# EAGLE schematic xio (EAGLE 5.02)
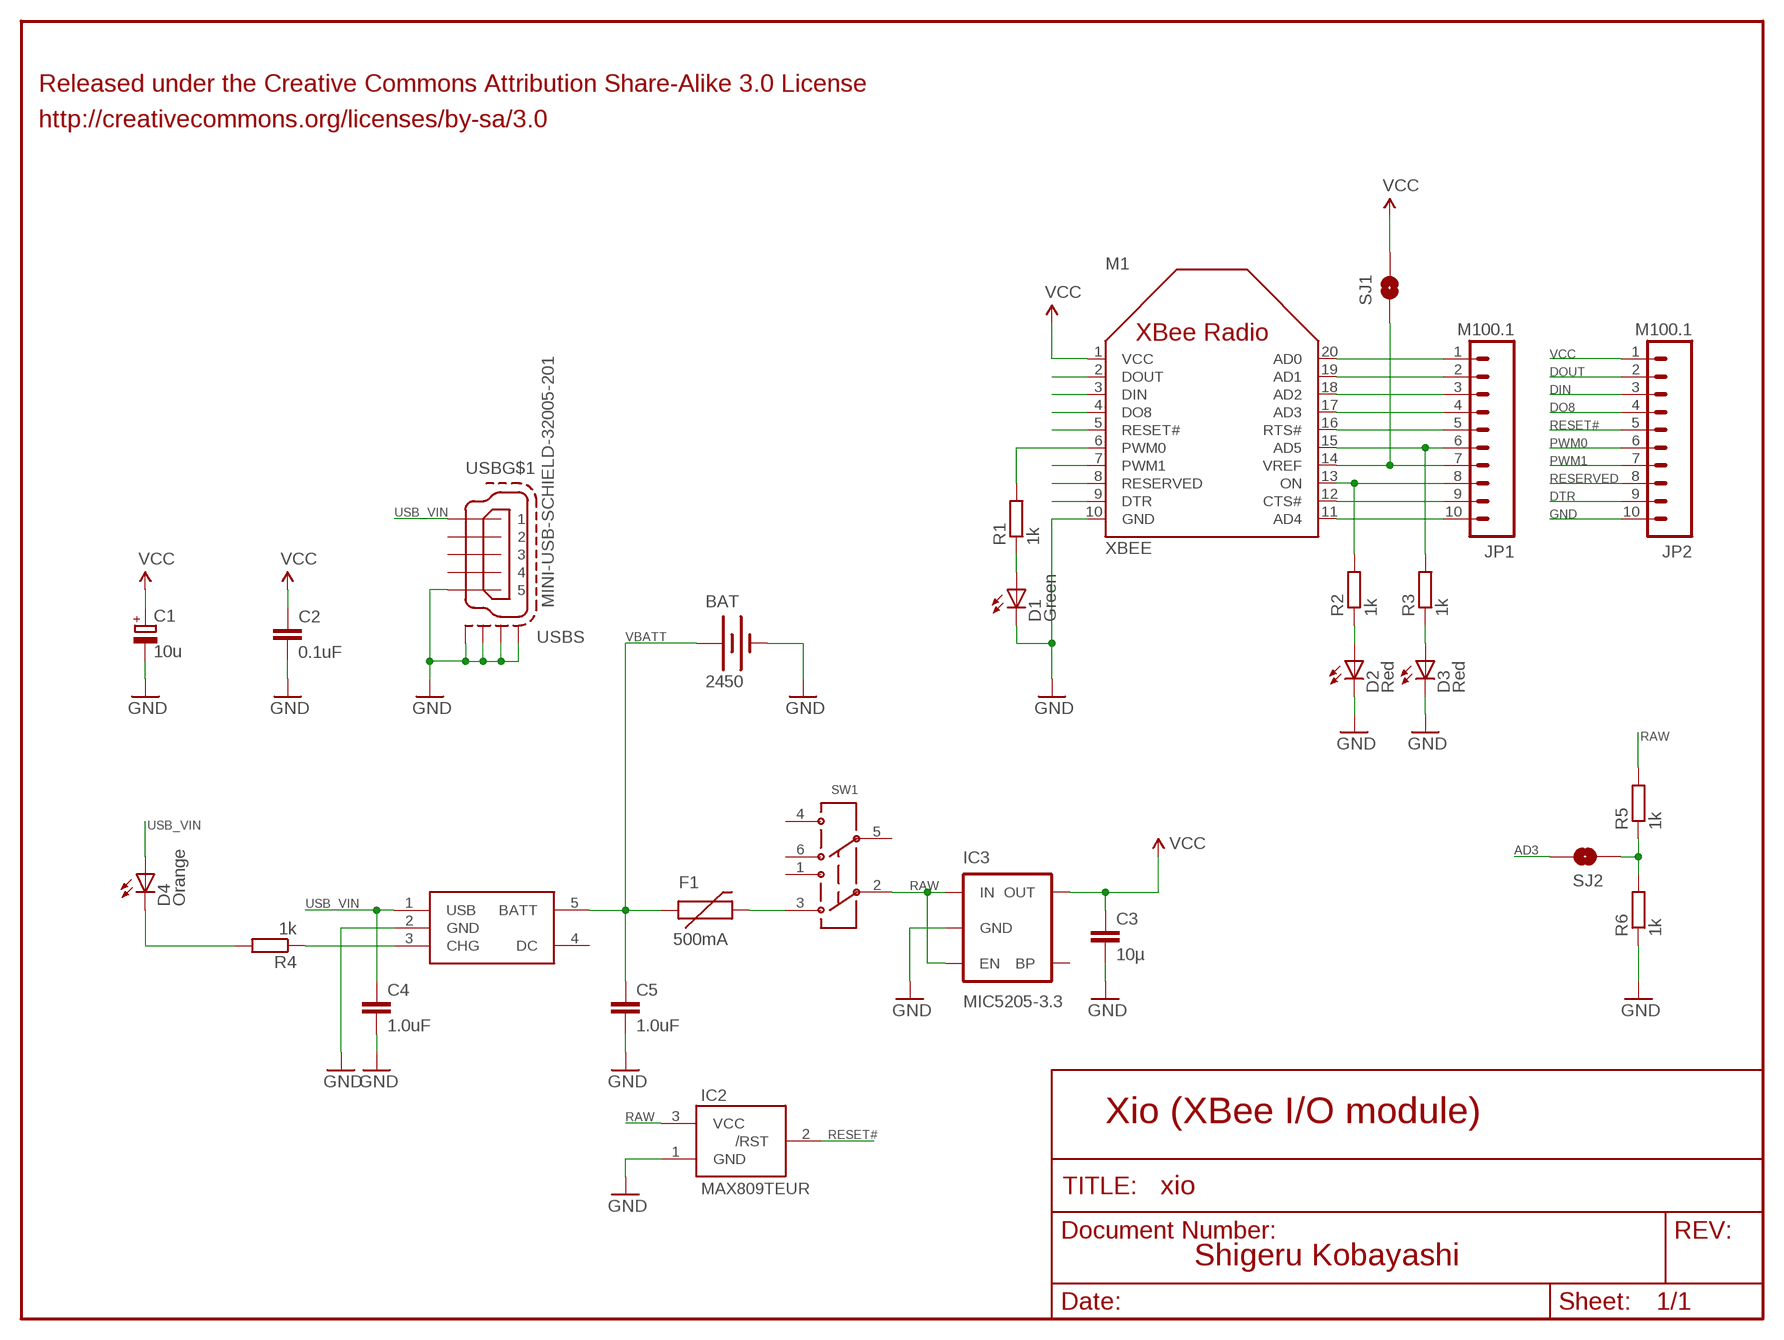
[diagram p0: schematic, sheet 1]

## Parts
BAT  2450  BATTERY  [3009]
C1  10u  CPOL-EUC  [PANASONIC_C]
C2  0.1uF  CAP0603  [0603]
C3  10µ  C-EUC0805K  [C0805K]
C4  1.0uF  CAP0603  [0603]
C5  1.0uF  CAP0603  [0603]
D1  Green  LEDCHIPLED_0805  [CHIPLED_0805]
D2  Red  LEDCHIPLED_0805  [CHIPLED_0805]
D3  Red  LEDCHIPLED_0805  [CHIPLED_0805]
D4  Orange  LEDCHIPLED_0805  [CHIPLED_0805]
F1  500mA  PTCSMD  [PTC-1206]
IC1  MAX1555  [SOT23-5]
IC2  MAX809TEUR  [SOT23]
IC3  MIC5205-3.3  V_REG_LDOSMD  [SOT23-5]
JP1  M100.1  [1X10]
JP2  M100.1  [1X10]
M1  XBEE  [XBEE]
R1  1k  R-EU_R0603  [R0603]
R2  1k  R-EU_R0603  [R0603]
R3  1k  R-EU_R0603  [R0603]
R4  1k  R-EU_R0603  [R0603]
R5  1k  R-EU_R0603  [R0603]
R6  1k  R-EU_R0603  [R0603]
SJ1  SOLDERJUMPERNO  [SJ-NO]
SJ2  SOLDERJUMPERNO  [SJ-NO]
SW1  AYZ0202  [AYZ0202]
USB  MINI-USB-SCHIELD-32005-201  [32005-201]

## Nets
AD3: JP1.4 M1.17(AD3) SJ2.2
AD4: JP1.10 M1.11(AD4)
DIN: JP2.3 M1.3(DIN)
DO8: JP2.4 M1.4(DO8)
DOUT: JP2.2 M1.2(DOUT)
DTR: JP2.9 M1.9(DTR)
GND: BAT.- C1.- C2.2 C3.2 C4.2 C5.2 D1.C D2.C D3.C IC1.2(GND) IC2.1(GND) IC3.2(GND) JP2.10 M1.10(GND) R6.1 USB.5 USB.M1(S:S1) USB.M2(S:S2) USB.M3(S:S3) USB.M4(S:S4)
N$1: JP1.8 M1.13(ON) R2.2
N$2: JP1.1 M1.20(AD0)
N$3: D1.A R1.1
N$6: D2.A R2.1
N$7: JP1.2 M1.19(AD1)
N$8: D4.C R4.2
N$9: F1.2 SW1.3
N$10: JP1.3 M1.18(AD2)
N$11: IC1.3(CHG) R4.1
N$13: JP1.5 M1.16(RTS#)
N$14: JP1.6 M1.15(AD5) R3.2
N$15: JP1.7 M1.14(VREF) SJ1.1
N$16: JP1.9 M1.12(CTS#)
N$18: D3.A R3.1
N$19: R5.1 R6.2 SJ2.1
PWM0: JP2.6 M1.6(PWM0) R1.2
PWM1: JP2.7 M1.7(PWM1)
RAW: IC2.3(VCC) IC3.1(IN) IC3.3(EN) R5.2 SW1.2
RESERVED: JP2.8 M1.8(RESERVED)
RESET#: IC2.2(/RST) JP2.5 M1.5(RESET#)
USB_VIN: C4.1 D4.A IC1.1(USB) USB.1
VBATT: BAT.+@1(+) C5.1 F1.1 IC1.5(BATT)
VCC [VCC]: C1.+ C2.1 C3.1 IC3.5(OUT) JP2.1 M1.1(VCC) SJ1.2
Unconnected: IC1.4(DC) IC3.4(BP) SW1.1 SW1.4 SW1.5 SW1.6 USB.2 USB.3 USB.4

## Notes on the sheet
- Released under the Creative Commons Attribution Share-Alike 3.0 License
- http://creativecommons.org/licenses/by-sa/3.0
- Xio (XBee I/O module)
- Shigeru Kobayashi

## Library data of the parts
BAT = keystone:BATTERY: Battery Holders 2032 coin cell and 2450 coin cell.
C1 = rcl:CPOL-EU: POLARIZED CAPACITOR, European symbol
C2 C4 C5 = SparkFun:CAP: Capacitor Standard 0603 ceramic capacitor, and 0.1" leaded capacitor.
C3 = rcl:C-EU: CAPACITOR, European symbol
D1-D4 = led:LED: LED OSRAM: - CHIPLED LG R971, LG N971, LY N971, LG Q971, LY Q971, LO R971, LY R971 LH N974, LH R974 LS Q976, LO Q976, LY Q976 LO Q996 - Hyper CHIPLED LW Q18S LB Q993, LB Q99A, LB R99A - SideLED LS A670, LO A670, LY A670, LG A670, LP A670 LB A673, LV A673, LT A673, LW A673 LH A674 LY A675 LS A676, LA A676, LO A676, LY A676, LW A676 LS A679, LY A679, LG A679 - Hyper Micro SIDELED® LS Y876, LA Y876, LO Y876, LY Y876 LT Y87S - SmartLED LW L88C, LW L88S LB L89C, LB L89S, LG L890 LS L89K, LO L89K, LY L89K LS L896, LA L896, LO L896, LY L896 - TOPLED LS T670, LO T670, LY T670, LG T670, LP T670 LSG T670, LSP T670, LSY T670, LOP T670, LYG T670 LG T671, LOG T671, LSG T671 LB T673, LV T673, LT T673, LW T673 LH T674 LS T676, LA T676, LO T676, LY T676, LB T676, LH T676, LSB T676, LW T676 LB T67C, LV T67C, LT T67C, LS T67K, LO T67K, LY T67K, LW E67C LS E67B, LA E67B, LO E67B, LY E67B, LB E67C, LV E67C, LT E67C LW T67C LS T679, LY T679, LG T679 LS T770, LO T770, LY T770, LG T770, LP T770 LB T773, LV T773, LT T773, LW T773 LH T774 LS E675, LA E675, LY E675, LS T675 LS T776, LA T776, LO T776, LY T776, LB T776 LHGB T686 LT T68C, LB T68C - Hyper Mini TOPLED® LB M676 - Mini TOPLED Santana® LG M470 LS M47K, LO M47K, LY M47K Source: http://www.osram.convergy.de - LUMILED® LXK2-PW12-R00, LXK2-PW12-S00, LXK2-PW14-U00, LXK2-PW14-V00 LXK2-PM12-R00, LXK2-PM12-S00, LXK2-PM14-U00 LXK2-PE12-Q00, LXK2-PE12-R00, LXK2-PE12-S00, LXK2-PE14-T00, LXK2-PE14-U00 LXK2-PB12-K00, LXK2-PB12-L00, LXK2-PB12-M00, LXK2-PB14-N00, LXK2-PB14-P00, LXK2-PB14-Q00 LXK2-PR12-L00, LXK2-PR12-M00, LXK2-PR14-Q00, LXK2-PR14-R00 LXK2-PD12-Q00, LXK2-PD12-R00, LXK2-PD12-S00 LXK2-PH12-R00, LXK2-PH12-S00 LXK2-PL12-P00, LXK2-PL12-Q00, LXK2-PL12-R00 Source: www.luxeon.com
F1 = SparkFun:PTC: Resettable Fuse PTC Resettable Fuse. Spark Fun Electronics SKU : COM-08357
IC1 = SparkFun:MAX1555: MAX1555 Lithium Charger IC SOT-23 Lithium Polymer charging IC. Schematic element and footprint proven. Spark Fun Electronics SKU : COM-00674
IC2 = maxim-10:MAX809*: 3-Pin Microprocessor Reset Circuit
IC3 = SparkFun:V_REG_LDO: Voltage Regulator LDO Standard 150mA LDO voltage regulator in SOT-23 layout. Micrel part MIC5205. BP (by-pass) pin is used to lower output noise with 470pF cap.
JP1 JP2 = SparkFun:M10: Header 10 Standard 10-pin 0.1" header. Use with straight break away headers (SKU : PRT-00116), right angle break away headers (PRT-00553), swiss pins (PRT-00743), machine pins (PRT-00117), and female headers (PRT-00115).
M1 = digi_xbee:XBEE
R1-R6 = rcl:R-EU_: RESISTOR, European symbol
SJ1 SJ2 = SparkFun:SOLDERJUMPER: Solder Jumper Standard SMD solder jumper. Used to automate production. Two varients : Normally Open and Normally Closed are the same, but have different paste layers. NC will have a large amount of paste and should jumper during reflow.
SW1 = SparkFun:AYZ0202: SPDT Slide Switch Simple SMD single-pull double-throw slide switch. Good for less than 350mA power switch, switching UARTs between devices, etc. Spark Fun Electronics SKU : COM-00597
USB = con-cypressindustries:MINI-USB-SCHIELD-: MINI USB-B Conector Source: www.cypressindustries.com

## Net classes
0 Default: width 0.203 mm
1 VCC: width 0.381 mm
2 LEDPower: width 0.203 mm
3 ButtonSignal: width 0.203 mm